# EAGLE schematic MB (EAGLE 7.1.0)
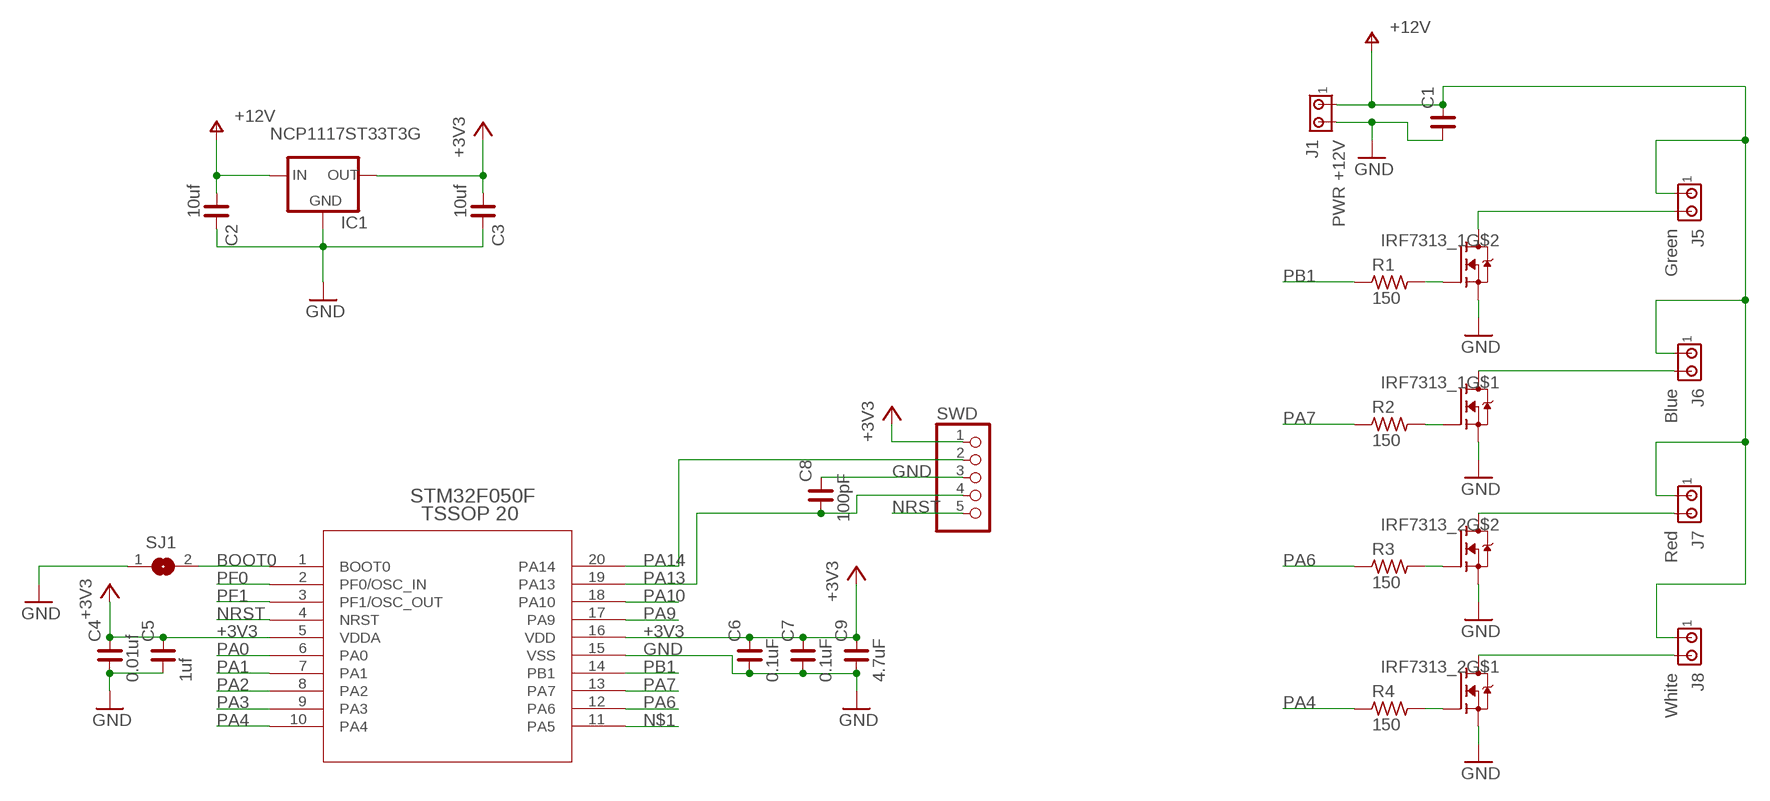
[diagram p0: schematic, sheet 1]

## Parts
C1  C_1206  [C1206]
C2  10uf  C_1206  [C1206]
C3  10uf  C_1206  [C1206]
C4  0.01uf  C_1206  [C1206]
C5  1uf  C_1206  [C1206]
C6  0.1uF  C_1206  [C1206]
C7  0.1uF  C_1206  [C1206]
C8  100pF  C_1206  [C1206]
C9  4.7uF  C_1206  [C1206]
IC1  NCP1117ST33T3G  LM1117  [SOT223]
IRF7313_1  IRF7313  [SO-8]
IRF7313_2  IRF7313  [SO-8]
J1  PWR +12V  MTA02-100  [10X02MTA]
J5  Green  MTA02-100  [10X02MTA]
J6  Blue  MTA02-100  [10X02MTA]
J7  Red  MTA02-100  [10X02MTA]
J8  White  MTA02-100  [10X02MTA]
R1  150  R_1206  [R1206]
R2  150  R_1206  [R1206]
R3  150  R_1206  [R1206]
R4  150  R_1206  [R1206]
SJ1  SJ  [SJ]
SWD  PINHD-1X05_2.54-90°-S  [1X05/90-S]
U$4  STM32F050F4P6  [TSSOP20]

## Nets
+3V3: C3.1 C4.2 C5.2 C6.2 C7.2 C9.2 IC1.2(OUT) SWD.1 U$4.5(VDDA) U$4.16(VDD)
BOOT0: SJ1.2 U$4.1(BOOT0)
GND: C1.1 C2.2 C3.2 C4.1 C5.1 C6.1 C7.1 C8.2 C9.1 IC1.1(GND) IRF7313_1.1(S) IRF7313_1.3(S) IRF7313_2.1(S) IRF7313_2.3(S) J1.2 SJ1.1 SWD.3 U$4.15(VSS)
N$1: U$4.11(PA5)
N$2 [PWR]: IRF7313_1.5(D) IRF7313_1.6(D) J5.2
N$5: IRF7313_1.4(G) R1.2
N$6: IRF7313_1.2(G) R2.2
N$7: IRF7313_2.2(G) R4.2
N$8: IRF7313_2.4(G) R3.2
N$12 [PWR]: IRF7313_1.7(D) IRF7313_1.8(D) J6.2
N$14 [PWR]: IRF7313_2.5(D) IRF7313_2.6(D) J7.2
N$19 [PWR]: IRF7313_2.7(D) IRF7313_2.8(D) J8.2
NRST: SWD.5 U$4.4(NRST)
PA0: U$4.6(PA0)
PA1: U$4.7(PA1)
PA2: U$4.8(PA2)
PA3: U$4.9(PA3)
PA4: R4.1 U$4.10(PA4)
PA6: R3.1 U$4.12(PA6)
PA7: R2.1 U$4.13(PA7)
PA9: U$4.17(PA9)
PA10: U$4.18(PA10)
PA13: C8.1 SWD.4 U$4.19(PA13)
PA14: SWD.2 U$4.20(PA14)
PB1: R1.1 U$4.14(PB1)
PF0: U$4.2(PF0/OSC_IN)
PF1: U$4.3(PF1/OSC_OUT)
V+ [PWR]: C1.2 C2.1 IC1.3(IN) J1.1 J5.1 J6.1 J7.1 J8.1

## Library data of the parts
C1-C9 = rc-master-smd:C_: NON-POLARIZED CAP
IC1 = v-reg-3:LM1117
IRF7313_1 IRF7313_2 = my-library:IRF7313
J1 J5-J8 = con-amp:MTA02-100: AMP connector
R1-R4 = rc-master-smd:R_: RESISTOR
SJ1 = jumper:SJ: SMD solder JUMPER
SWD = pinhead-2:PINHD-1X05: PIN HEADER
U$4 = STM32F0:STM32F050F4P6: STM32F050F4P6

## Net classes
1 PWR: width 0.635 mm, clearance 0.635 mm